# Altium schematic sheet Power Delivery.SchDoc
size A3
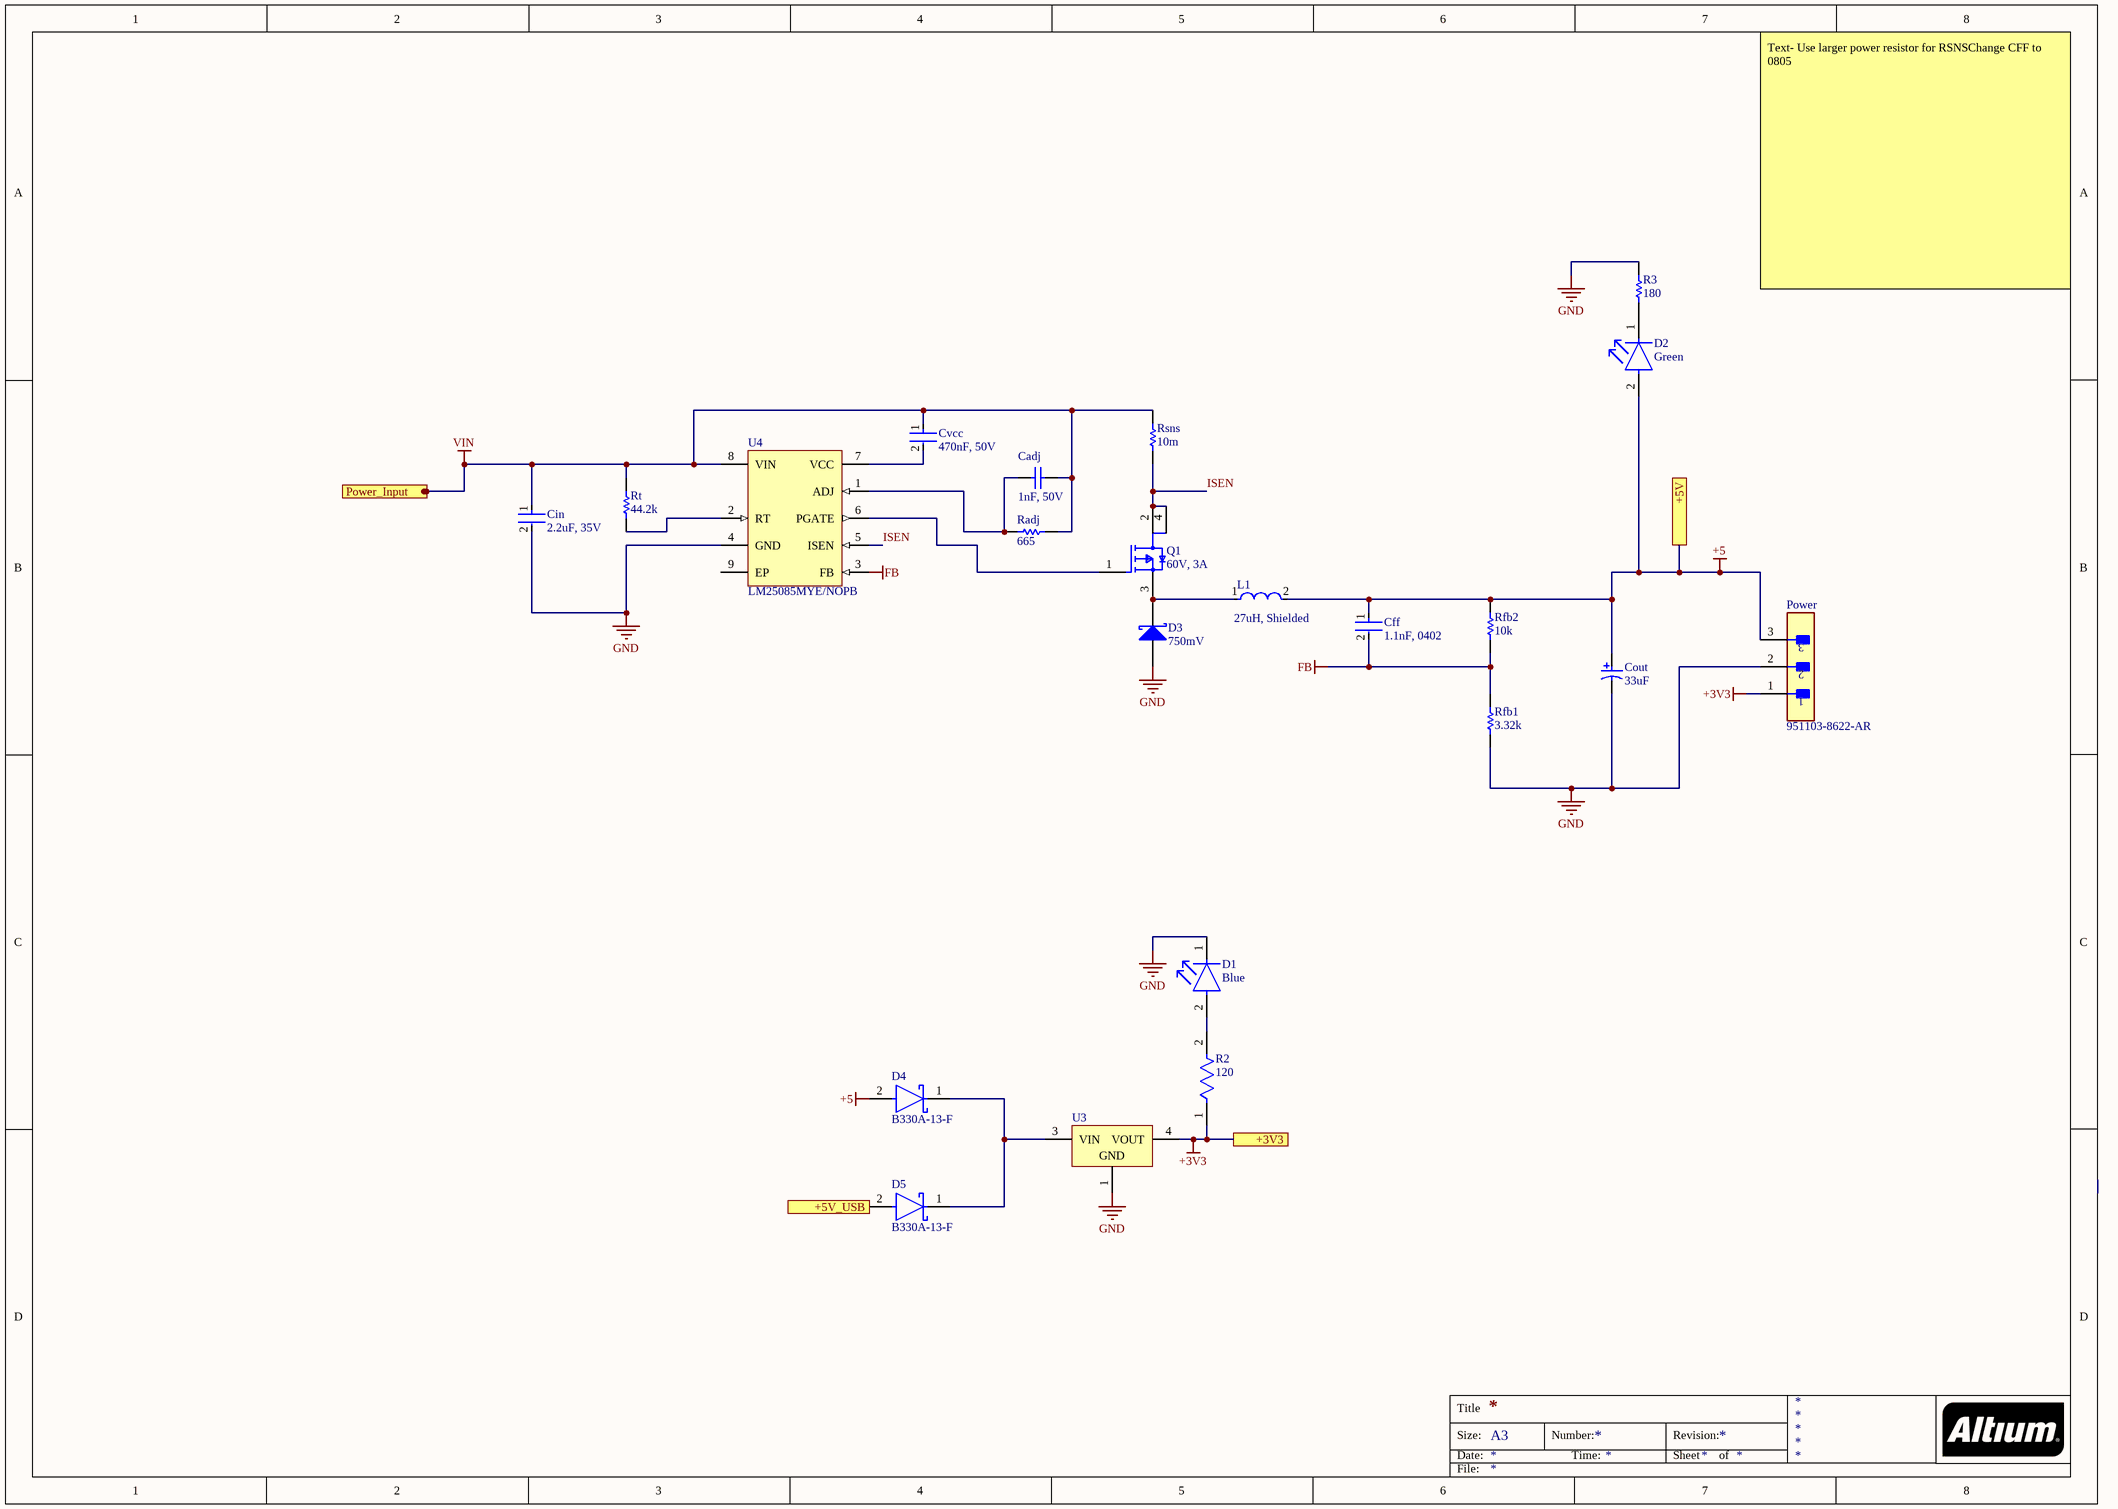
[diagram p0: Power Delivery.SchDoc]

## Parts
Cadj  1nF, 50V  [CAPC2013X94X50ML20T25]
Cff  1.1nF, 0402  [FP-C0402-BB-MFG]
Cin  2.2uF, 35V  [FP-C2012-125-0_2-IPC_B]
Cout  33uF  [NIC-CAPA2-6.3X5.8_V]
Cvcc  470nF, 50V  [FP-GCM21B-0_15-IPC_A]
D1  Blue  [FP-LTST-C191TBKT-MFG]
D2  Green  [FP-6_541-5056_01-4-MFG]
D3  750mV  [DIOD-SOD-323-2_V]
D4  B330A-13-F  [FP-SMA-MFG]
D5  B330A-13-F  [FP-SMA-MFG]
L1  27uH, Shielded  [FP-SRR1260-MFG]
Power  951103-8622-AR  [FP-951103-8622-AR-MFG]
Q1  60V, 3A  [FP-SOT223-IPC_C]
R2  120  [FP-AC0805-MFG]
R3  180  [RESC2013X70X40ML20T20]
Radj  665  [RESC2013X70X40LL20T20]
Rfb1  3.32k  [RESC2013X55X40NL15T20]
Rfb2  10k  [RESC2013X60X35NL10T20]
Rsns  10m  [RESC2013X60X35LL10T20]
Rt  44.2k  [RESC2013X50X30LL20T20]
U3  (no value)  [TO-252_N]
U4  LM25085MYE/NOPB  [DGN0008A_L]

## Ports
+3V3, +5V, +5V_USB, Power_Input

## Nets
+3V3: Power.1 R2.1 U3.4(VOUT) ; port +3V3
+5: Cff.1 Cout.1 D2.2(A) D4.2(A) L1.2 Power.3 Rfb2.2 ; port +5V
FB: Cff.2 Rfb1.2 Rfb2.1 U4.3(FB)
GND: Cin.2 Cout.2 D1.1(C) D3.1(A) Power.2 R3.2 Rfb1.1 U3.1(GND) U4.4(GND)
VIN: Cadj.1 Cin.1 Cvcc.1 Radj.2 Rsns.2 Rt.2 U4.8(VIN) ; port Power_Input
+5V_USB: D5.2(A) ; port +5V_USB
ISEN: Q1.2(D) Q1.4(D) Rsns.1 U4.5(ISEN)
NetCadj_2: Cadj.2 Radj.1 U4.1(ADJ)
NetCvcc_2: Cvcc.2 U4.7(VCC)
NetD1_2: D1.2(A) R2.2
NetD2_1: D2.1(C) R3.1
NetD3_2: D3.2(K) L1.1 Q1.3(S)
NetD4_1: D4.1(C) D5.1(C) U3.3(VIN)
NetQ1_1: Q1.1(G) U4.6(PGATE)
NetRt_1: Rt.1 U4.2(RT)

Not connected (* = marked no-connect by the designer): U4 9(EP)

## Notes on the sheet
- Text- Use larger power resistor for RSNSChange CFF to 0805
- Title
- Size:
- Date:
- A3
- Number:
- Time:
- Revision:
- Sheet
- of
- File:

## Library data of the parts
Cadj = CMP-2007-04448-1: Part Number: 08055F102KAT2A; Manufacturer: AVX Interconnect / Elco
Cff = CMP-1034-01638-3: CAP CER 1100PF 50V C0G/NP0 0402; Manufacturer Part Number: C0402C112J5GACTU; Manufacturer: Kemet; Tolerance: 0.05; Capacitance: 1,100 pF; Temperature Characteristic: C0G; Value: 1,100 pF; Temperature Coefficient: 15%; Height: 0.55mm; Lead Free: Yes; ComponentLink2URL: https://content.kemet.com/datasheets/KEM_C1002_X7R_SMD.pdf; Mouser Description: Cap Ceramic 0.0011uF 50V C0G 5% SMD 0402 125°C Paper T/R; Temperature Range Low: -55°C; Octopart: https://octopart.com/c0402c112j5gactu-kemet-19757367; Device Class L1: Passive Components; Package: C0402-BB; Category: Cap; RoHS: TRUE; Ipc Land Pattern Name: CAPC10050X50; Temperature: -55°C to +125°C; Device Class L2: Capacitors; ComponentLink2Description: Datasheet; Material: Ceramic; Voltage Rating: 50 V; Digikey Description: CAP CER 1100PF 50V C0G/NP0 0402; Automotive: No; Temperature Range High: +125°C; Device Class L3: Ceramic Capacitors
Cin = CMP-08246-002978-1: Multilayer Ceramic Capacitors 2.2μF ±10% 35V X6S SMD 0805; Termination: SMD/SMT; Dielectric: X6S; Mount: Surface Mount; Case/Package: 0805; Package Quantity: 2000; Width: 0.049inch; Voltage Rating: 35V; Max Operating Temperature: 105°C; Dielectric Material: Ceramic; Weight: 0.000194oz; Tolerance: 10%; Capacitance: 2.2uF; Packaging: Tape and Reel; Series: C; Height: 1.25mm; Min Operating Temperature: -55°C; Case Code (Metric): 2012; RoHS Compliant: Yes; Thickness: 0.057inch; Voltage Rating (DC): 35V; Lead Free: Lead Free; Length: 0.079inch; Case Code (Imperial): 0805
Cout = CMP-0687-00040-1: Aluminum Electrolytic Capacitor, UD Series, Low Impedance, 33 uF, 16 V, + / - 20%, -55 to 105 degC, Chip Type, 6.3 x 5.8 mm D x L, Pb-Free, Reel; PartNumber: UUD1C330MCL1GS; Manufacturer: Nichicon; Tolerance Rated Capacitance: -20 to 20%; Endurance Time: 2000 h; Impedance: 0.44 Ohm; Packing: Dia382mm Reel; Rated Ripple Current (at 100kHz): 230 mA; Rated Voltage: 16 V; ComponentLink3Description: Package Specification; ComponentLink2Description: Datasheet; ComponentLink1Description: Manufacturer URL; PackageDescription: 2-Pin Surface Mount Device, Diameter 6.3 mm, Height 5.8 mm, Pitch 5.4 mm; ComponentLink2URL: http://products.nichicon.co.jp/en/pdf/XJA043/e-ud.pdf; PackageReference: CAPAE-D6.3H5.8; ComponentLink1URL: http://www.nichicon.co.jp/; Length: 5.8 mm; RoHS: TRUE; ComponentLink3URL: http://products.nichicon.co.jp/en/pdf/XJA043/e-ud.pdf; Diameter: 6.3 mm; DatasheetVersion: 08/2012; Mounting Technology: Surface Mount; Rated Capacitance: 33 uF
Cvcc = CMP-2007-03360-2: Ceramic Capacitor for Automotive 470nF ±10% 50VDC X7R 0805 Embossed T/R; Case Code (Imperial): 0805; Length: 2mm; Thickness: 0.055inch; Width: 0.049inch; Dielectric: X7R; Termination: SMD/SMT; Voltage Rating (DC): 50V; Case Code (Metric): 2012; Packaging: Tape and Reel; Capacitance: 470nF; Case/Package: 0805; Radiation Hardening: No; Depth: 1.25mm; Max Operating Temperature: 125°C; Tolerance: 10%; Package Quantity: 10000; Height: 1.25mm; Mount: Surface Mount; Ratings: AEC-Q200; Min Operating Temperature: -55°C; Voltage Rating: 50V
D1 = CMP-22017-000008-1: LED BLUE CLEAR CHIP SMD; Lens Color: Colorless; Dominant Wavelength: 475nm; Forward Current: 20mA; Wavelength: 468nm; Viewing Angle: 130°; Power Dissipation: 76mW; Luminous Intensity: 180mcd; Reverse Voltage: 5V; Number of Elements: 1; Lens Style: Diffused; Forward Voltage: 3.8V; Max Power Dissipation: 75mW; Case Code (Metric): 1608; Packaging: Tape and Reel; Case/Package: 0603; Depth: 1.6mm; Mount: Surface Mount; Lead Free: Lead Free; Min Operating Temperature: -20°C; Lens Transparency: Clear; Illumination Color: Blue; Height: 0.55mm; Test Current: 20mA; Case Code (Imperial): 0603; Max Operating Temperature: 80°C; Number of Pins: 2; Length: 0.8mm; Radiation Hardening: No; Package Quantity: 1; Number of LEDs: 1; Width: 0.8mm; Color: Blue
D2 = CMP-02520-000009-1: LED GREEN 0603 SMD; Manufacturer Part Number: TLMP1100-GS08; Manufacturer: Vishay; Max Junction Temp: +120°C; Automotive Grade: Grade 3; Reverse Voltage: 6V; Led Orientation: Top View; Forward Voltage: 2.1V; Luminous Intensity: 15mcd; Forward Current: 20mA; Colour: Pure green; Peak Emmision Wavelength: 562nm; Wavelength: 561nm; Viewing Angle: 160°; Power Dissipation: 90mW; Digikey Description: LED GREEN 0603 SMD; Package: 6.541-5056.01-4; Ambient Temperature Range High: +100°C; Height: 0.65mm; Device Class L1: Optoelectronics; Device Class L2: LEDs; Mouser Description: Standard LEDs - SMD Pure Green; Temperature Range High: +120°C; RoHS: TRUE; Ambient Temperature Range Low: -40°C; Temperature: to +120°C; ComponentLink2URL: http://www.vishay.com/docs/83173/tlmb1100.pdf; Lead Free: Yes; Octopart: https://octopart.com/tlmp1100-gs08-vishay-55433993; Automotive: Yes; Device Class L3: unset; ComponentLink2Description: Datasheet; Category: Diode
D3 = CMP-2000-07037-1: Schottky Barrier Diode, 30 V, -65 to 150 degC, 2-Pin SOD-323, RoHS, Tape and Reel; Pd - Power Dissipation: 250mW; Ir - Reverse Current: 1uA; Brand: DiodesIncorporated; Ifsm - Forward Surge Current: 0.75A; Vf - Forward Voltage: 0.8V; Unit Weight: 0.000173oz; Type: SurfaceMountSchottkyBarrierDiode; Vrrm - Repetitive Reverse Voltage: 30V; Configuration: Single; If - Forward Current: 0.1A; Mounting Style: SMD/SMT; Operating Temperature Range: -65Cto+150C; Series: SD107; Minimum Operating Temperature: -65C; Maximum Operating Temperature: +150C; Datasheet Version: Rev. 10-2, 12/2009; Termination Style: SMD/SMT; Product Category: SchottkyDiodes&Rectifiers; RoHS: True; Product: SchottkyDiodes; Package Description: 2-Pin Small Outline Diode, Body 1.7 x 1.3 mm; Package Reference: SOD-323-2; Package / Case: SOD-323; Factory Pack Quantity: 3000; Manufacturer: DiodesIncorporated; Manufacturer URL: http://www.diodes.com/; Length: 1.8mm; Packaging: Reel; Width: 1.4mm; Mounting Technology: SurfaceMount; Datasheet URL: http://www.diodes.com/_files/datasheets/ds30129.pdf; Technology: Si; Height: 1mm
D4 D5 = CMP-2000-05896-2: DIODE SCHOTTKY 30V 3A SMA; Manufacturer: Diodes; Max Junction Temp: +150°C; Standoff Height: 0.05mm; Peak Reverse Current: 0.5mA; Capacitance: 200pF; Value: 200pF; Max Surge Forward Current: 80A; Automotive Grade: Grade 0; Octopart: https://octopart.com/b330a-13-f-diodes+inc.-325808; Working Reverse Voltage: 30V; ComponentLink2URL: https://www.diodes.com/assets/Datasheets/ds30891.pdf; Dc Blocking Voltage: 30V; Reverse Voltage: 30V; Digikey Description: DIODE SCHOTTKY 30V 3A SMA; Device Class L1: Discrete Semiconductors; Temperature: -55°C to +150°C; RoHS: TRUE; Device Class L2: Diodes; Device Class L3: Schottky Diodes; Package: SMA; ComponentLink2Description: Datasheet; Automotive: Yes; Temperature Range High: +150°C; Manufacturer Part Number: B330A-13-F; Lead Free: Yes; Temperature Range Low: -55°C; Max Repetitive Reverse Voltage: 30V; Footprint Url: https://www.diodes.com/assets/Package-Files/SMA.pdf; Forward Current: 3A; Mouser Description: Schottky Diodes & Rectifiers 30V 3A; Height: 2.4mm; Category: Diode
L1 = CMP-07248-000018-1: FIXED IND 27UH 3.6A 45 MOHM SMD; Manufacturer Part Number: SRR1260-270M; Manufacturer: Bourns; Tolerance: 20%; Core Material: Ferrite; Q Factor: 26; Series Resistance: 45mΩ; Saturation Current: 3.3A; Self Resonant Frequency: 12.7MHz; Test Frequency: 2.52MHz; ComponentLink2URL: https://www.bourns.com/docs/product-datasheets/srr1260.pdf?sfvrsn=a4409aa5_15; Mouser Description: Fixed Inductors 27uH 20% SMD 1260; Temperature Range Low: -40°C; Temperature Range High: +125°C; ComponentLink2Description: Datasheet; Lead Free: Yes; Device Class L1: Passive Components; Value: 27uH; Height: 6.5mm; Rms Current: 3.6A; Category: Ind; Device Class L2: Inductors; Composition: Wirewound; RoHS: TRUE; Automotive: No; Digikey Description: FIXED IND 27UH 3.6A 45 MOHM SMD; Package: SRR1260; Device Class L3: Fixed Inductors; Inductance: 27uH; Octopart: https://octopart.com/srr1260-270m-bourns-1930921; Temperature: -40°C to +125°C
Power = CMP-05379-000003-1: CONN HEADER VERT 3POS 2MM; Manufacturer: 3M; Conn Gender: Male; Current Rating: 2A; Number Of Contacts: 3; Conn Orientation: Straight; Digikey Description: CONN HEADER VERT 3POS 2MM; Device Class L3: unset; Category: Conn; Height: 6.3mm; Manufacturer Part Number: 951103-8622-AR; RoHS: TRUE; Contact Material: Gold,Nickel; ComponentLink2Description: Datasheet; Temperature Range Low: -55°C; Device Class L1: Connectors; Pitch: 2mm; Mouser Description: Header; PinStrip; CopperAlloy; HighTempThermoplastic; 3Cnts; 1A; RtAngle; 951Series; Octopart: https://octopart.com/951103-8622-ar-3m-14400669; Package: 951103-8622-AR; Lead Free: Yes; Device Class L2: Headers and Wire Housings; Temperature Range High: +125°C; ComponentLink2URL: http://multimedia.3m.com/mws/media/1400506O/3m-pin-strip-header-951-series-78-5100-2653-3.pdf; Automotive: No; Temperature: -55°C to +125°C; Number Of Rows: 1
Q1 = CMP-12801-000089-1: MOSFET PCH 60V 3A SOT223; Rds On Max: 150mR; Max Power Dissipation: 1.2W; Input Capacitance: 708pF; Continuous Drain Current (ID): 3A; Min Operating Temperature: -55°C; Mount: Surface Mount; Case/Package: TO-261-4; Packaging: Tape and Reel; Drain to Source Voltage (Vdss): 60V; Max Operating Temperature: 150°C
R2 = CMP-03412-037390-1: RES SMD 120 OHM 5% 1/8W 0805; Manufacturer: Yageo; Manufacturer Part Number: AC0805JR-07120RL; Value: 120Ω; Tolerance: 0.05; Automotive Grade: Grade 0; Voltage Rating: 150V; Ipc Land Pattern Name: RESC200125X50; Category: Res; RoHS: TRUE; Package: AC0805; Temperature Range High: +155°C; Device Class L2: Resistors; Temperature: -55°C to +155°C; Composition: Thick Film; Footprint Url: http://www.yageo.com/exep/pages/download/literatures/PYu-R_Mount_10.pdf; ComponentLink2URL: http://www.yageo.com/documents/recent/PYu-AC_51_RoHS_L_6.pdf; Device Class L1: Passive Components; Resistance: 120Ω; Height: 0.6mm; ComponentLink2Description: Datasheet; Octopart: https://octopart.com/ac0805jr-07120rl-yageo-52448213; Automotive: Yes; Digikey Description: RES SMD 120 OHM 5% 1/8W 0805; Temperature Range Low: -55°C; Lead Free: Yes; Device Class L3: Chip SMD Resistors; Series: AC; Power Rating: 1/8W; Mouser Description: Thick Film Resistors - SMD 1/8W 120ohm 5% AEC-Q200
R3 = CMP-2001-00362-1: Manufacturer: Panasonic; Part Number: ERJ-6GEYJ181V
Radj = CMP-2001-00267-5: Chip Resistor, 665 Ohm, +/- 1%, 0.125 W, -55 to 155 degC, 0805 (2012 Metric), RoHS, Tape and Reel; Manufacturer: Panasonic; Voltage Rating: 150 V; Mounting Technology: Surface Mount; ComponentLink2URL: http://industrial.panasonic.com/cdbs/www-data/pdf/RDA0000/AOA0000C86.pdf; ComponentLink1URL: http://www.panasonic.com/; PackageReference: 0805; Mount: Surface Mount; Package Quantity: 5000; Length: 2 mm; ComponentLink2Description: Datasheet; DatasheetVersion: 04/2015; Min Operating Temperature: -55 degC; PackageDescription: 2-Pin Surface Mount Device, Body 2 x 1.25 mm; ComponentLink1Description: Manufacturer URL; RoHSCompliant: true; Height: 0.6 mm; REACH SVHC: Unknown; Packaging: Tape and Reel; Max Operating Temperature: 155 degC
Rfb1 = CMP-2001-04771-1: Part Number: TNPW08053K32BEEN; Manufacturer: Vishay Dale
Rfb2 = CMP-1659-00013-4: Chip Resistor, 10 KOhm, +/- 1%, 0.125 W, -55 to 155 degC, 0805 (2012 Metric), RoHS, Tape and Reel; Manufacturer: Yageo; Voltage Rating: 150 V; Mount: Surface Mount; ComponentLink1Description: Manufacturer URL; ComponentLink2URL: http://www.yageo.com/documents/recent/PYu-RC_Group_51_RoHS_L_04.pdf; Pins: 2; Length: 2 mm; Min Operating Temperature: -55 degC; Height: 0.5 mm; Mounting Technology: Surface Mount; RoHSCompliant: true; REACH SVHC: No SVHC; ComponentLink1URL: http://www.yageo.com/; Max Operating Temperature: 155 degC; PackageReference: 0805; DatasheetVersion: Rev. 4, 02/2016; Package Quantity: 5000; Packaging: Tape and Reel; ComponentLink2Description: Datasheet; PackageDescription: 2-Pin Surface Mounted Device, Body 2 x 1.25 mm
Rsns = CMP-2001-01428-1: Part Number: RL0805FR-070R01L; Manufacturer: Yageo
Rt = CMP-2001-03921-1: Part Number: CRCW080544K2FKEA; Manufacturer: Vishay Dale
U3 = CMP-0244-00088-1: Fixed Low Drop Positive Voltage Regulator, 3.3V, 3-Pin DPAK, Tape and Reel; ComponentLink1Description: Manufacturer URL; PackageVersion: 2011; PackageReference: TO-252; ComponentLink2Description: Datasheet; ComponentLink1URL: http://www.st.com; DatasheetVersion: 1/11/2011; PackageDescription: 3-Pin Transistor Outline Package 2.28 mm Pitch, 9.7 mm Lead Span (DPAK); ComponentLink2URL: http://www.st.com/internet/com/TECHNICAL_RESOURCES/TECHNICAL_LITERATURE/DATASHEET/CD00000544.pdf
U4 = CMP-0063-01331-3: 42V Constant On-Time PFET Buck Switching Controller, 8-pin eMSOP, Pb-Free; Manufacturer: Texas Instruments; CompType: MiscPower; PowerWise: Y; PackageTopMarking: ZXTT*SVYB; PackageDescription: Molded Mini-SO, Exposed Pad, .118 x .118 x .034in Body, 8 Lead, .0256in Pitch; ComponentLink1Description: Datasheet URL; ComponentLink1URL: http://www.ti.com/general/docs/lit/getliterature.tsp?genericPartNumber=LM25085&fileType=pdf; PackageReference: DGN0008A; Code_JEDEC: MO-187-AA; RoHS: Y; PinCount: 8